# Altium schematic sheet TIDA-01576_ADS8686S_ISO_Interface_Pg4-Isolated Power Supply.SchDoc: Isolated Power Supply
size 431 x 279 mm; Date: Not shown in title block; ApprovedBy: Not shown in title block; CheckedBy: Not shown in title block; Author: Not shown in title block; CompanyName: Not shown in title block; Engineer: Not shown in title block; Organization: Not shown in title block; Address1: Not shown in title block; Address2: Not shown in title block; Address3: Not shown in title block; Address4: Not shown in title block; DocumentNumber: 1; Revision: Use project parameter SCH_Rev; SheetNumber: 4; SheetTotal: 8; PageSetup: Record=PageOptions|CenterHorizontal=True|CenterVertical=True|PrintScale=1.00|XCorrection=1.00|YCorrection=1.00|PrintKind=0|BorderSize=5000000|LeftOffset=0|BottomOffset=0|Orientation=2|PaperLength=1000|PaperWidth=1000|Scale=100|PaperSource=15|PrintQuality=600|MediaType=1|DitherType=10|PaperKind=Letter|PrintScaleMode=1; CurrentTime: Not shown in title block; CurrentDate: Not shown in title block; Time: Not shown in title block; DocumentFullPathAndName: Not shown in title block; DocumentName: Not shown in title block; ModifiedDate: Not shown in title block; ImagePath: Not shown in title block
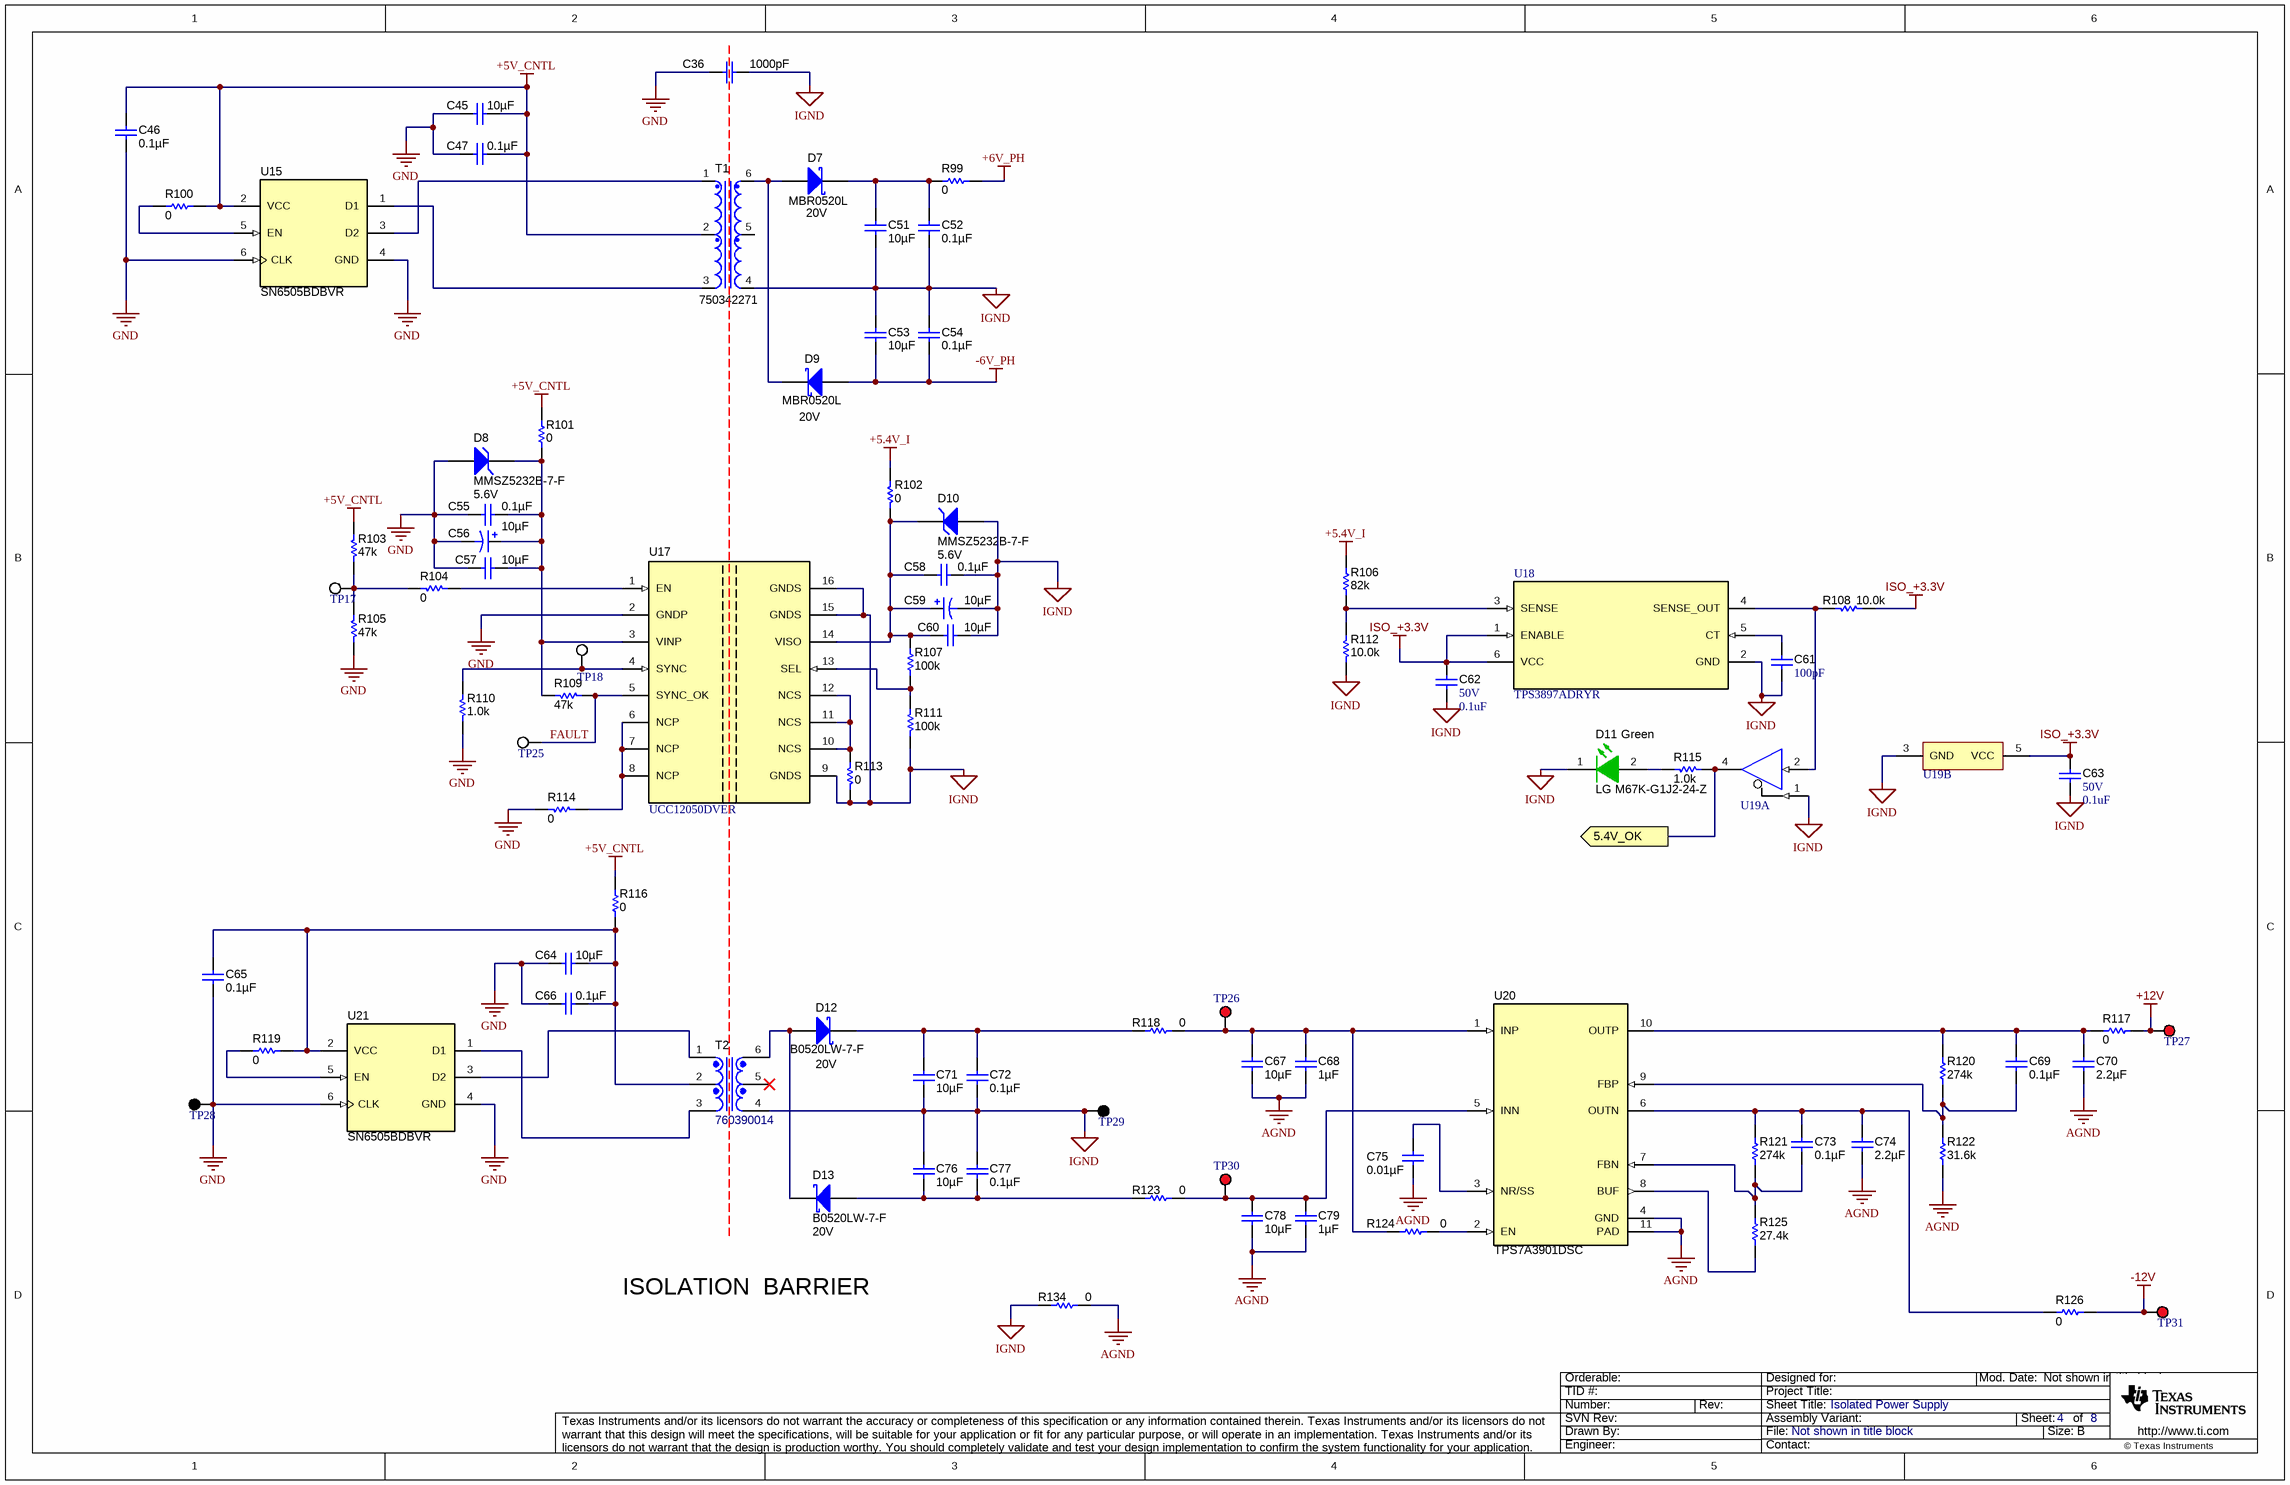
[diagram p0: TIDA-01576_ADS8686S_ISO_Interface_Pg4-Isolated Power Supply.SchDoc]

## Parts
C36  value 1000pF  [CAP_200mil]
C45  ValueDisplayed: 10µF  [1210]
C46  ValueDisplayed: 0.1µF  [0603]
C47  ValueDisplayed: 0.1µF  [0603]
C51  ValueDisplayed: 10µF  [1210]
C52  ValueDisplayed: 0.1µF  [0603_HV]
C53  ValueDisplayed: 10µF  [1210]
C54  ValueDisplayed: 0.1µF  [0603_HV]
C55  ValueDisplayed: 0.1µF  [0603]  (hidden comment: C0603C104K5RACTU)
C56  ValueDisplayed: 10µF  [3528-21]  (hidden comment: T491B106K016AT)
C57  ValueDisplayed: 10µF  [1206_180]  (hidden comment: GRM31CR61H106KA12L)
C58  ValueDisplayed: 0.1µF  [0603]  (hidden comment: C0603C104K5RACTU)
C59  ValueDisplayed: 10µF  [3528-21]  (hidden comment: T491B106K016AT)
C60  ValueDisplayed: 10µF  [1206_180]  (hidden comment: GRM31CR61H106KA12L)
C61  ValueDisplayed: 100pF  [0603]  (hidden comment: 06035A101FAT2A)
C62  VDC_V: 50V  ValueDisplayed: 0.1uF  [0603]  (hidden comment: C0603C104K5RACTU)
C63  VDC_V: 50V  ValueDisplayed: 0.1uF  [0603]  (hidden comment: C0603C104K5RACTU)
C64  ValueDisplayed: 10µF  [1210]
C65  ValueDisplayed: 0.1µF  [0603]
C66  ValueDisplayed: 0.1µF  [0603]
C67  ValueDisplayed: 10µF  [1206_180]  (hidden comment: C1210C106M5RACTU)
C68  ValueDisplayed: 1µF  [0603]  (hidden comment: C1608X7R1E105K080AB)
C69  ValueDisplayed: 0.1µF  [0603]  (hidden comment: GMK107BJ104KAHT)
C70  ValueDisplayed: 2.2µF  [0805_HV]  (hidden comment: C0805C225K8RACTU)
C71  ValueDisplayed: 10µF  [1210]
C72  ValueDisplayed: 0.1µF  [0603]
C73  ValueDisplayed: 0.1µF  [0603]  (hidden comment: GMK107BJ104KAHT)
C74  ValueDisplayed: 2.2µF  [0805_HV]  (hidden comment: C0805C225K8RACTU)
C75  ValueDisplayed: 0.01µF  [0603]  (hidden comment: GRM188R70J103KA01D)
C76  ValueDisplayed: 10µF  [1210]
C77  ValueDisplayed: 0.1µF  [0603]
C78  ValueDisplayed: 10µF  [1206_180]  (hidden comment: C1210C106M5RACTU)
C79  ValueDisplayed: 1µF  [0603]  (hidden comment: C1608X7R1E105K080AB)
D7  MBR0520L  value 20V  [SOD-123]
D8  MMSZ5232B-7-F  value 5.6V  [SOD-123]
D9  MBR0520L  value 20V  [SOD-123]
D10  MMSZ5232B-7-F  value 5.6V  [SOD-123]
D11  LG M67K-G1J2-24-Z  value Green  [LG_M67K_Green]
D12  B0520LW-7-F  value 20V  [SOD-123]
D13  B0520LW-7-F  value 20V  [SOD-123]
R99  ValueDisplayed: 0  [0603]  (hidden comment: CRCW06030000Z0EA)
R100  value 0  [0603]  (hidden comment: CRCW06030000Z0EA)
R101  ValueDisplayed: 0  [0603]  (hidden comment: CRCW06030000Z0EA)
R102  ValueDisplayed: 0  [0603]  (hidden comment: CRCW06030000Z0EA)
R103  ValueDisplayed: 47k  [0603]  (hidden comment: RC0603JR-0747KL)
R104  ValueDisplayed: 0  [0603]  (hidden comment: CRCW06030000Z0EA)
R105  ValueDisplayed: 47k  [0603]  (hidden comment: RC0603JR-0747KL)
R106  ValueDisplayed: 82k  [0603]  (hidden comment: CRCW060382K0JNEA)
R107  ValueDisplayed: 100k  [0603]  (hidden comment: RC0603FR-07100KL)
R108  value 10.0k  [0603]  (hidden comment: CRCW060310K0FKEA)
R109  ValueDisplayed: 47k  [0603]  (hidden comment: RC0603JR-0747KL)
R110  ValueDisplayed: 1.0k  [0603]  (hidden comment: RC0603JR-071KL)
R111  ValueDisplayed: 100k  [0603]  (hidden comment: RC0603FR-07100KL)
R112  value 10.0k  [0603]  (hidden comment: CRCW060310K0FKEA)
R113  ValueDisplayed: 0  [0603]  (hidden comment: CRCW06030000Z0EA)
R114  ValueDisplayed: 0  [0603]  (hidden comment: CRCW06030000Z0EA)
R115  ValueDisplayed: 1.0k  [0603]  (hidden comment: RC0603JR-071KL)
R116  value 0  [0603]  (hidden comment: CRCW06030000Z0EA)
R117  ValueDisplayed: 0  [0603]  (hidden comment: CRCW06030000Z0EA)
R118  ValueDisplayed: 0  [0603]  (hidden comment: CRCW06030000Z0EA)
R119  value 0  [0603]  (hidden comment: CRCW06030000Z0EA)
R120  ValueDisplayed: 274k  [0603]  (hidden comment: CRCW0603274KFKEA)
R121  ValueDisplayed: 274k  [0603]  (hidden comment: CRCW0603274KFKEA)
R122  ValueDisplayed: 31.6k  [0603]  (hidden comment: CRCW060331K6FKEA)
R123  ValueDisplayed: 0  [0603]  (hidden comment: CRCW06030000Z0EA)
R124  ValueDisplayed: 0  [0603]  (hidden comment: CRCW06030000Z0EA)
R125  ValueDisplayed: 27.4k  [0603]  (hidden comment: CRCW060327K4FKEA)
R126  ValueDisplayed: 0  [0603]  (hidden comment: CRCW06030000Z0EA)
R134  ValueDisplayed: 0  [0603]  (hidden comment: CRCW06030000Z0EA)
T1  750342271  [760390015]
T2  760390014  [Wurth_760390013]
TP17  5002  [Keystone5002]  (value not drawn)
TP18  5002  [Keystone5002]  (value not drawn)
TP25  5002  [Keystone5002]  (value not drawn)
TP26  5000  [Keystone5000]  (value not drawn)
TP27  5000  [Keystone5000]  (value not drawn)
TP28  5001  [Keystone5001]  (value not drawn)
TP29  5001  [Keystone5001]  (value not drawn)
TP30  5000  [Keystone5000]  (value not drawn)
TP31  5000  [Keystone5000]  (value not drawn)
U15  SN6505BDBVR  [DBV0006A_N]
U17  UCC12050DVER  [DVE0016A]
U18  TPS3897ADRYR  [DRY0006A]
U19  SN74LVC1G125DCKR  [DCK0005A_N]  (value not drawn)  (parts A,B of 2)
U20  TPS7A3901DSC  [DSC0010J]
U21  SN6505BDBVR  [DBV0006A_N]

## Ports
5.4V_OK (out)

## Nets
+5.4V_I: R102.2 R106.1
+5V_CNTL: C45.2 C46.2 C47.2 R100.1 R101.2 R103.2 R116.2 T1.2 U15.2(VCC)
+6V_PH: R99.1
+12V: R117.2 TP27.1
-6V_PH: C53.2 C54.2 D9.2(A)
-12V: R126.2 TP31.1
AGND: C67.1 C68.2 C70.2 C74.2 C75.2 C78.1 C79.2 R122.1 R134.2 U20.4(GND) U20.11(PAD)
GND: C36.1 C45.1 C46.1 C47.1 C55.1 C56.2(-) C57.2 C64.1 C65.1 C66.1 D8.2(A) R105.1 R110.1 R114.2 TP28.1 U15.4(GND) U15.6(CLK) U17.2(GNDP) U21.4(GND) U21.6(CLK)
IGND: C36.2 C51.2 C52.2 C53.1 C54.1 C58.1 C59.2(-) C60.1 C61.2 C62.1 C63.2 C71.2 C72.2 C76.1 C77.1 D10.2(A) D11.1(K) R111.1 R112.2 R113.2 R134.1 T1.4 T2.4 TP29.1 U17.9(GNDS) U17.15(GNDS) U17.16(GNDS) U18.2(GND) U19.1(~{OE}) U19.3(GND)
ISO_+3.3V: C62.2 C63.1 R108.1 U18.1(ENABLE) U18.6(VCC) U19.5(VCC)
5.4V_OK: R115.2 U19.4(Y) ; port 5.4V_OK
FAULT: R109.1 TP25.1 U17.5(SYNC_OK)
NetC51_1: C51.1 C52.1 D7.1(K) R99.2
NetC55_2: C55.2 C56.1(+) C57.1 D8.1(K) R101.1 R109.2 U17.3(VINP)
NetC58_2: C58.2 C59.1(+) C60.2 D10.1(K) R102.1 R107.2 U17.14(VISO)
NetC61_1: C61.1 U18.5(CT)
NetC64_2: C64.2 C65.2 C66.2 R116.1 R119.1 T2.2 U21.2(VCC)
NetC67_2: C67.2 C68.1 R118.2 R124.1 TP26.1 U20.1(INP)
NetC69_1: C69.1 C70.1 R117.1 R120.2 U20.10(OUTP)
NetC69_2: C69.2 R120.1 R122.2 U20.9(FBP)
NetC71_1: C71.1 C72.1 D12.1(K) R118.1
NetC73_1: C73.1 C74.1 R121.2 R126.1 U20.6(OUTN)
NetC73_2: C73.2 R121.1 R125.2 U20.7(FBN)
NetC75_1: C75.1 U20.3(NR/SS)
NetC76_2: C76.2 C77.2 D13.2(A) R123.1
NetC78_2: C78.2 C79.1 R123.2 TP30.1 U20.5(INN)
NetD7_2: D7.2(A) D9.1(K) T1.6
NetD11_2: D11.2(A) R115.1
NetD12_2: D12.2(A) D13.1(K) T2.6
NetR100_2: R100.2 U15.5(EN)
NetR103_1: R103.1 R104.2 R105.2 TP17.1
NetR104_1: R104.1 U17.1(EN)
NetR106_2: R106.2 R112.1 U18.3(SENSE)
NetR107_1: R107.1 R111.2 U17.13(SEL)
NetR108_2: R108.2 U18.4(SENSE_OUT) U19.2(A)
NetR110_2: R110.2 TP18.1 U17.4(SYNC)
NetR113_1: R113.1 U17.10(NCS) U17.11(NCS) U17.12(NCS)
NetR114_1: R114.1 U17.6(NCP) U17.7(NCP) U17.8(NCP)
NetR119_2: R119.2 U21.5(EN)
NetR124_2: R124.2 U20.2(EN)
NetR125_1: R125.1 U20.8(BUF)
NetT1_1: T1.1 U15.3(D2)
NetT1_3: T1.3 U15.1(D1)
NetT2_1: T2.1 U21.3(D2)
NetT2_3: T2.3 U21.1(D1)

Not connected (* = marked no-connect by the designer): T1 5; T2 5*

## Notes on the sheet
- ISOLATION  BARRIER
- Drawn By:
- SVN Rev:
- Number:
- TID #:
- Orderable:
- Rev:
- Sheet Title:
- File:
- Project Title:
- Designed for:
- Assembly Variant:
- Mod. Date:
- Sheet:
- Size:
- of
- B
- http://www.ti.com
- Texas Instruments and/or its licensors do not warrant the accuracy or completeness of this specification or any information contained therein. Texas Instruments and/or its licensors do not warrant that this design will meet the specifications, will be suitable for your application or fit for any particular purpose, or will operate in an implementation. Texas Instruments and/or its licensors do not warrant that the design is production worthy. You should completely validate and test your design implementation to confirm the system functionality for your application.
- Engineer:
- Contact:
- © Texas Instruments

## Library data of the parts
C36 = 202R18W102KV4E: CAP CER 1000PF 1KV 10% RADIAL; PartNumber: S102K29Y5PN63J5R; Manufacturer: Vishay BC Components; Polarized: N; CompType: Capacitor; Tolerance_%: 0; ValueDisplayed: 1000pF; RoHS: Y; Value2: 1kv; MountType: radial; Technology: Ceramic; Publisher: Texas Instruments; ComponentLink1Description: Datasheet link; ComponentLink1URL: http://www.johansondielectrics.com/images/stories/catalog/JDI-Product-Catalog.pdf; Supplier 1: Digi-Key; Supplier Part Number 1: 1251PH-ND
C45 C51 C53 C64 C71 C76 = GMK325AB7106MM-T: CAP, CERM, 10uF, 35V, +/-20%, X7R, 1210; Manufacturer: Taiyo Yuden; Polarized: N; CompType: Capacitor; U/M: EA; Cap_F: 0.00001; Tolerance_%: 20; Value1: Unknown; VDC_V: 35; TaMin_C: -55; TaMax_C: 125; PackageReference: 1210; PartNumber: GMK325AB7106MM-T; SymbolVersion: 2008-07-09; Value: 10uF; RoHS: Y; Value2: 35V; MountType: SMT; Technology: Ceramic; Cap_Case: 1210; Publisher: Texas Instruments; LatestRevisionDate: 2013-12-06; ComponentLink1Description: Datasheet link; ComponentLink1URL: http://www.yuden.co.jp/productdata/catalog/en/mlcc01_e.pdf; Supplier 1: Digi-Key; Supplier Part Number 1: 587-2779-1-ND; Supplier 2: Mouser; Supplier Part Number 2: 963-GMK325AB7106MM-T; Supplier 3: Farnell; Supplier Part Number 3: 1894510; TempCo: X7R; Published: 2008-06-19
C46 C47 C55 C58 C65 C66 C72 C77 = C0603C104K5RACTU: CAP, CERM, 0.1uF, 50V, +/-10%, X7R, 0603; Manufacturer: Kemet; Polarized: N; CompType: Capacitor; U/M: EA; Cap_F: 0.0000001; Tolerance_%: 10; Value1: Unknown; VDC_V: 50; TaMin_C: -55; TaMax_C: 125; SymbolVersion: 2008-07-09; Value: 0.1uF; PartNumber: C0603C104K5RACTU; PackageReference: 0603; RoHS: Y; Value2: 50V; MountType: SMT; Technology: Ceramic; TempCo: X7R; Cap_Case: 0603; Published: 2008-06-19; Publisher: Texas Instruments; LatestRevisionDate: 2013-12-06; ComponentLink1Description: Datasheet link; ComponentLink1URL: http://www.kemet.com/kemet/web/homepage/kechome.nsf/vapubfiles/F3102_Y5V.pdf/$file/F3102_Y5V.pdf; Supplier 1: Digi-Key; Supplier Part Number 1: 399-5089-1-ND; Supplier 2: Mouser; Supplier Part Number 2: 80-C0603C104K5R; Supplier 3: Farnell; Supplier Part Number 3: 1288255
C52 C54 = C0603C104K5RACTU: CAP, CERM, 0.1uF, 50V, +/-10%, X7R, 0603; Manufacturer: Kemet; Polarized: N; CompType: Capacitor; U/M: EA; Cap_F: 0.0000001; Tolerance_%: 10; Value1: Unknown; VDC_V: 50; TaMin_C: -55; TaMax_C: 125; Cap_Case: 0603; SymbolVersion: 2008-07-09; Value: 0.1uF; PartNumber: C0603C104K5RACTU; PackageReference: 0603; RoHS: Y; Value2: 50V; MountType: SMT; Technology: Ceramic; TempCo: X7R; Published: 2008-06-19; Publisher: Texas Instruments; LatestRevisionDate: 2013-12-06; ComponentLink1Description: Datasheet link; ComponentLink1URL: http://www.kemet.com/kemet/web/homepage/kechome.nsf/vapubfiles/F3102_Y5V.pdf/$file/F3102_Y5V.pdf; Supplier 1: Digi-Key; Supplier Part Number 1: 399-5089-1-ND; Supplier 2: Mouser; Supplier Part Number 2: 80-C0603C104K5R; Supplier 3: Farnell; Supplier Part Number 3: 1288255
C56 C59 = 293D106X9016B2TE3: CAP, TA, 10 µF, 16 V, +/- 10%, 2 ohm, SMD; Manufacturer: Vishay-Sprague; Polarized: Y; CompType: Capacitor; Value: 10uF; U/M: EA; Cap_F: 0.00001; Tolerance_%: 10; Value1: 2 ohm; VDC_V: 16; Value2: 16V; ESR_ohm: 2; IRMS_A: 0.21; TaMin_C: -55; TaMax_C: 125; Cap_Case: B; SymbolVersion: 2008-07-09; PartNumber: T491B106K016AT; PackageReference: 3528-21; RoHS: Y; MountType: SMT; Technology: TA; Series: 293D; Publisher: Texas Instruments; LatestRevisionDate: 2014-08-11; LatestRevisionNote: Updated supplier links; ComponentLink1Description: Datasheet link; ComponentLink1URL: http://www.vishay.com/docs/40002/293d.pdf; Supplier 1: Digi-Key; Supplier Part Number 1: 399-3706-1-ND
C57 C60 = GRM31CR61H106KA12L: CAP, CERM, 10 µF, 50 V, +/- 10%, X5R, 1206; Manufacturer: MuRata; Polarized: N; CompType: Capacitor; Value: 10uF; U/M: EA; Cap_F: 0.00001; Tolerance_%: 10; Value1: Unknown; VDC_V: 50; Value2: 50V; TaMin_C: -55; TaMax_C: 85; Cap_Case: 1206; SizeArea_mm2: 5.12; SizeAreaWB_mm2: 10.92; SizeX_mm: 3.2; SizeY_mm: 1.6; SizeZ_mm: 1.8; AEC Category: Q200; SymbolVersion: 2008-07-09; PartNumber: GRM31CR61H106KA12L; PackageReference: 1206; RoHS: Y; MountType: SMT; Technology: Ceramic; TempCo: X5R; Published: 2008-06-19; Publisher: Texas Instruments; LatestRevisionDate: 2016-10-28; ComponentLink1Description: Datasheet link; ComponentLink1URL: http://search.murata.co.jp/Ceramy/image/img/A01X/G101/ENG/GRM31CR61H106KA12-01.pdf; Supplier 1: Digi-Key; Supplier Part Number 1: 490-5961-1-ND; Supplier 2: Mouser; Supplier Part Number 2: 81-GRM31CR61H106KA2L; Supplier 3: Farnell; Supplier Part Number 3: 1845762RL; AEC Qualified: N; AEC Grade: N/A
C61 = CMP-0006762-4: CAP, CERM, 100 pF, 50 V, +/- 1%, C0G/NP0, 0603; Manufacturer: AVX; TaMin_C: -55°C; Polarized: N; SizeAreaWB_mm2: 4.68; Value1: Unknown; U/M: EA; TaMax_C: 125°C; SizeZ_mm: 1; SizeX_mm: 1.6; SizeY_mm: 0.8; Value2: 50V; SizeArea_mm2: 1.28; Value: 100pF; AEC Category: Q200; Supplier Part Number 2: 95W2725; Publisher: Texas Instruments; Supplier 2: Newark; Supplier Part Number 3: 581-06035A101F; TempCo: C0G/NP0; Supplier 3: Mouser; Published: 2008-06-19; RoHS: Y; MountType: SMT; Supplier 1: Digi-Key; PackageReference: 0603; Tolerance_%: 1%; Cap_Case: 0603; CompType: Capacitor; LatestRevisionDate: 2017-03-09; PartNumber: 06035A101FAT2A; AEC Qualified: N; Cap_F: 100pF; VDC_V: 50V; ComponentLink1Description: Datasheet link; AEC Grade: N/A; Supplier Part Number 1: 478-6202-1-ND; Technology: Ceramic; ComponentLink1URL: http://datasheets.avx.com/C0GNP0-Dielectric.pdf
C62 C63 = CMP-0006861-4: CAP, CERM, 0.1 uF, 50 V, +/- 10%, X7R, 0603; Manufacturer: Kemet; TaMin_C: -55°C; Polarized: N; SizeAreaWB_mm2: 4.68; Value1: Unknown; U/M: EA; Value: 0.1uF; TaMax_C: 125°C; SizeZ_mm: 1; SizeX_mm: 1.6; SizeY_mm: 0.8; SizeArea_mm2: 1.28; Cap_F: 100nF; AEC Category: Q200; Supplier Part Number 2: 80-C0603C104K5R; Publisher: Texas Instruments; Supplier 2: Mouser; Supplier Part Number 3: 1288255; TempCo: X7R; Supplier 3: Farnell; Published: 2008-06-19; RoHS: Y; MountType: SMT; Supplier 1: Digi-Key; PackageReference: 0603; Tolerance_%: 10%; Cap_Case: 0603; Value2: 50V; CompType: Capacitor; LatestRevisionDate: 2017-03-09; PartNumber: C0603C104K5RACTU; AEC Qualified: ?; ComponentLink1Description: Datasheet link; Supplier Part Number 1: 399-5089-1-ND; Technology: Ceramic; ComponentLink1URL: http://www.kemet.com/kemet/web/homepage/kechome.nsf/vapubfiles/F3102_Y5V.pdf/$file/F3102_Y5V.pdf
C67 C78 = CL31B106KBHNNNE: CAP, CERM, 10µF ±20% 50V Ceramic Capacitor X7R 1210; Manufacturer: Kemet; Polarized: N; Value: 10uF; U/M: EA; Cap_F: 0.00001; Tolerance_%: 10; Value1: Unknown; VDC_V: 50; TaMin_C: -55; TaMax_C: 125; Cap_Case: 1206; SizeArea_mm2: 5.12; SizeAreaWB_mm2: 10.92; SizeX_mm: 3.2; SizeY_mm: 1.6; SizeZ_mm: 1.8; AEC Category: Q200; CompType: Capacitor; SymbolVersion: 2008-07-09; PartNumber: C1210C106M5RACTU; PackageReference: 1206; RoHS: Y; Value2: 50V; MountType: SMT; Technology: Ceramic; TempCo: X7R; Published: 2008-06-19; Publisher: Texas Instruments; LatestRevisionDate: 2017-05-28; ComponentLink1Description: Datasheet link; ComponentLink1URL: https://www.samsungsem.com/kr/front/downloadcms.do?path=%2Fkr%2Fsupport%2Fproduct-search%2Fmlcc%2F__icsFiles%2Fafieldfile%2F2016%2F01%2F04&fileName=Data+sheet_CL31B106KBHNNNE.pdf; Supplier 1: Digi-Key; Supplier Part Number 1: 399-11630-1-ND; AEC Qualified: N; AEC Grade: N/A
C68 C79 = 885012206052: CAP, CERM,  1µF ±10% 25V Ceramic Capacitor X7R 0603; Manufacturer: TDK; Polarized: N; Value: 1uF; U/M: EA; Cap_F: 0.000001; Tolerance_%: 10; Value1: Unknown; VDC_V: 16; Value2: 16V; TaMin_C: -55; TaMax_C: 125; SizeArea_mm2: 1.28; SizeAreaWB_mm2: 4.68; SizeX_mm: 1.6; SizeY_mm: 0.8; SizeZ_mm: 1; AEC Category: Q200; Green_Lifecycle: Active; Green_REACh: Passed; CompType: Capacitor; SymbolVersion: 2008-07-09; PartNumber: C1608X7R1E105K080AB; PackageReference: 0603; RoHS: Y; MountType: SMT; Technology: Ceramic; TempCo: X7R; Cap_Case: 0603; Published: 2008-06-19; Publisher: Texas Instruments; LatestRevisionDate: 2017-05-28; ComponentLink1Description: Datasheet link; ComponentLink1URL: http://katalog.we-online.de/pbs/datasheet/885012206052.pdf; Supplier 1: Digi-Key; Supplier Part Number 1: 445-5956-1-ND; AEC Qualified: N; AEC Grade: N/A; Green_EU RoHS: Passed; Green_EU RoHS-2: Incomplete
C69 C73 = 06033C104JAT2A: 0.1µF ±10% 35V Ceramic Capacitor X5R 0603; Manufacturer: Taiyo Yuden; Polarized: N; Value: 0.1uF; U/M: EA; Cap_F: 0.0000001; Tolerance_%: 5; ESR_ohm: 0.05; Value1: 0.05 ohm; VDC_V: 25; Value2: 25V; TempCo: X7R; TaMin_C: -55; TaMax_C: 125; SizeArea_mm2: 1.28; SizeAreaWB_mm2: 4.68; SizeX_mm: 1.6; SizeY_mm: 0.8; SizeZ_mm: 1; AEC Category: Q200; CompType: Capacitor; SymbolVersion: 2008-07-09; PartNumber: GMK107BJ104KAHT; PackageReference: 0603; RoHS: Y; MountType: SMT; Technology: Ceramic; Cap_Case: 0603; Published: 2008-06-19; Publisher: Texas Instruments; LatestRevisionDate: 2017-04-15; ComponentLink1Description: Datasheet link; ComponentLink1URL: http://datasheets.avx.com/X7RDielectric.pdf; Supplier 1: Digi-Key; Supplier Part Number 1: 587-3357-1-ND; AEC Qualified: N; AEC Grade: N/A
C70 C74 = C0805C225K8RACTU: CAP, CERM, 2.2uF, 10V, +/-10%, X7R, 0805; Manufacturer: Kemet; Polarized: N; CompType: Capacitor; U/M: EA; Cap_F: 0.0000022; Tolerance_%: 10; ESR_Ohm: 0.008; Value1: 0.008 ohm; IRMS_A: 15.55; TaMin_C: -55; TaMax_C: 125; Cap_Case: 0805; SymbolVersion: 2008-07-09; Value: 2.2uF; PartNumber: C0805C225K8RACTU; PackageReference: 0805; RoHS: Y; VDC_V: 10; Value2: 10V; MountType: SMT; Technology: Ceramic; TempCo: X7R; Published: 2008-06-19; Publisher: Texas Instruments; LatestRevisionDate: 2014-05-28; ComponentLink1Description: Datasheet link; ComponentLink1URL: http://www.kemet.com/kemet/web/homepage/kechome.nsf/file/Partial%20Copy%20-%20Ceramic%20Surface%20Mount%20Capacitors/$file/F3102_CE.pdf; Supplier 1: Digi-Key; Supplier Part Number 1: 399-3522-1-ND; Supplier 2: Mouser; Supplier Part Number 2: 80-C0805C225K8R
C75 = GRM188R70J103KA01D: CAP, CERM, 0.01 µF, 6.3 V, +/- 10%, X7R, 0603; Manufacturer: MuRata; Polarized: N; CompType: Capacitor; Value: 0.01uF; U/M: EA; Cap_F: 0.00000001; Tolerance_%: 10; Value1: Unknown; VDC_V: 6.3; Value2: 6.3V; TaMin_C: -55; TaMax_C: 125; SymbolVersion: 2008-07-09; PartNumber: GRM188R70J103KA01D; PackageReference: 0603; RoHS: Y; MountType: SMT; Technology: Ceramic; TempCo: X7R; Cap_Case: 0603; Published: 2008-06-19; Publisher: Texas Instruments; LatestRevisionDate: 2015-02-10; ComponentLink1Description: Datasheet link; ComponentLink1URL: http://search.murata.co.jp/Ceramy/PnsearchViewAction.do?HnOFG=ON&HnNFG=ON&SEL_CNT=50&sLang=en&sKey=GRM188R70J103KA01D&x=9&y=9&search=startwith; Supplier 1: Digi-Key; Supplier Part Number 1: GRM188R70J103KA01D-ND
D7 D9 = MBR0520LT1G: Diode, Schottky, 20V, 0.5A, SOD-123; Manufacturer: Fairchild Semiconductor; U/M: EA; Vf_V: 0.385; Value2: 0.385V; Io_A: 0.5; Vr_V: 20; TJmax_C: 125; RJC_CperW: 150; CompType: Diode; SymbolVersion: 2008-12-08; PartNumber: MBR0520L; PackageReference: SOD-123; Value1: 0.5A; MountType: SMT; Type: Schottky; RoHS: Y; Published: 2008-06-26; Publisher: Texas Instruments; LatestRevisionDate: 2013-12-18; ComponentLink1Description: Datasheet link; ComponentLink1URL: http://www.onsemi.com/pub_link/Collateral/MBR0520LT1-D.PDF; Supplier 1: Digi-Key; Supplier Part Number 1: MBR0520LCT-ND; Supplier 2: Mouser; Supplier Part Number 2: 863-MBR0520LT1G; Supplier 3: Farnell; Supplier Part Number 3: 9556915
D8 D10 = MMSZ5232B-7-F: Diode, Zener, 5.6 V, 500 mW, SOD-123; Manufacturer: Diodes Inc.; SymbolCreator: a0412235; U/M: EA; Power_W: 0.5; Vz_V: 5.6; Value1: 0.5W; RJA_CperW: 350; AEC Category: Q101; SymbolVersion: 2010-08-25; PartNumber: MMSZ5232B-7-F; PackageReference: SOD-123; CompType: Zener; Vr_V: N/A; MountType: SMT; RoHS: Y; ComponentLink1Description: Datasheet link; ComponentLink1URL: http://www.diodes.com/datasheets/ds18010.pdf; Published: 2008-10-08; Publisher: Texas Instruments; LatestRevisionDate: 2016-03-21; LatestRevisionNote: Updated Supplier Data; Supplier 1: Digi-Key; Supplier Part Number 1: MMSZ5232B-FDICT-ND; Supplier 2: Mouser; Supplier Part Number 2: 621-MMSZ5232B-F; Supplier 3: Farnell; Supplier Part Number 3: 2061469; AEC Qualified: ?
D11 = LG M67K-G1J2-24-Z: LED, Green, SMD; Manufacturer: OSRAM; SymbolCreator: Altium; Type: AlInGaP; Vf_V: 1.8; Value2: 1.8V; Io_A: 0.002; Vr_V: 12; Tjmax_C: 125; Value1: W; Angle: 120; U/M: EA; SymbolVersion: 2015-01-20; PartNumber: LG M67K-G1J2-24-Z; PackageReference: 2x1.4mm; RoHS: Y; CompType: LED; MountType: SMT; Color: Green; Published: 2008-07-11; Publisher: Texas Instruments; ComponentLink1URL: http://www.digikey.com/product-detail/en/LG%20M67K-G1J2-24-Z/475-1406-1-ND/1802594; ComponentLink1Description: Datasheet link; LatestRevisionDate: 2016-09-26; Supplier 1: Digi-Key; Supplier Part Number 1: 475-1406-1-ND; Supplier 2: Mouser; Supplier Part Number 2: 720-LGM67KG1J224Z
D12 D13 = MBR0520LT1G: Diode, Schottky, 20V, 0.5A, SOD-123; Manufacturer: Diodes Inc; U/M: EA; Vf_V: 0.385; Value2: 0.385V; Io_A: 0.5; Vr_V: 20; TJmax_C: 125; RJC_CperW: 150; CompType: Diode; PartNumber: B0520LW-7-F; PackageReference: SOD-123; Value1: 0.5A; MountType: SMT; Type: Schottky; RoHS: Y; Published: 2008-06-26; Publisher: Texas Instruments; LatestRevisionDate: 2013-12-18; ComponentLink1Description: Datasheet link; ComponentLink1URL: http://www.onsemi.com/pub_link/Collateral/MBR0520LT1-D.PDF; Supplier 1: Digi-Key; Supplier Part Number 1: B0520LW-FDICT-ND
R99 R101 R102 R104 R113 R114 R117 R118 R123 R124 R126 R134 = CRCW06030000Z0EA: RES, 0, 5%, 0.1 W, 0603; Manufacturer: Vishay-Dale; CompType: Resistor; Value: 0; Value_Code: 0000; Tolerance_%: 5; Power_W: 0.1; Value2: 0.1W; VDC_V: 75; TempCo: 200 ppm/C; EIA_Code: E24; U/M: EA; SymbolVersion: 2009-05-29; PartNumber: CRCW06030000Z0EA; PackageReference: 0603; RoHS: Y; Res_ohm: 0; Value1: 5%; MountType: SMT; Technology: Thick Film; Published: 2008-06-26; Publisher: Texas Instruments; ComponentLink1Description: Datasheet link; ComponentLink1URL: http://www.vishay.com/docs/20035/dcrcwe3.pdf; Supplier 1: Digi-Key; Supplier Part Number 1: 541-0.0GCT-ND; Supplier 2: Mouser; Supplier Part Number 2: 71-CRCW0603-0-E3; Supplier 3: Farnell; Supplier Part Number 3: 1469739
  R99 R101 R102 R104 R113 R114: LatestRevisionDate: 2014-10-21
  R117 R118 R123 R124 R126 R134: LatestRevisionDate: 2014-12-16
R100 R116 R119 = CRCW06030000Z0EA: RES, 0 ohm, 5%, 0.1W, 0603; Manufacturer: Vishay-Dale; CompType: Resistor; Value_Code: 0000; Tolerance_%: 5; Power_W: 0.1; VDC_V: 75; TempCo: 200 ppm/C; EIA_Code: E24; U/M: EA; SymbolVersion: 2009-05-29; PartNumber: CRCW06030000Z0EA; PackageReference: 0603; RoHS: Y; Res_ohm: 0; Value1: 5%; Value2: 0.1W; MountType: SMT; Technology: Thick Film; Published: 2008-06-26; Publisher: Texas Instruments; LatestRevisionDate: 2014-05-20; ComponentLink1Description: Datasheet link; ComponentLink1URL: http://www.vishay.com/docs/20035/dcrcwe3.pdf; Supplier 1: Digi-Key; Supplier Part Number 1: 541-0.0GCT-ND; Supplier 2: Mouser; Supplier Part Number 2: 71-CRCW0603-0-E3; Supplier 3: Farnell; Supplier Part Number 3: 1469739
R103 R105 R109 = RC0603JR-0747KL: RES, 47 k, 5%, 0.1 W, 0603; Manufacturer: Yageo America; CompType: Resistor; Value: 47k; Res_ohm: 47000; Value_Code: 47k0; Tolerance_%: 5; Power_W: 0.1; Value2: 0.1W; VDC_V: 50; TempCo: 100 ppm/C; EIA_Code: E24; U/M: EA; SymbolVersion: 2009-05-29; PartNumber: RC0603JR-0747KL; PackageReference: 0603; RoHS: Y; Value1: 5%; MountType: SMT; Technology: Thick Film; Published: 2008-06-26; Publisher: Texas Instruments; LatestRevisionDate: 2014-12-16; ComponentLink1Description: Datasheet link; ComponentLink1URL: http://www.yageo.com/pdf/Pu-RC0603_51_PbFree_L_2.pdf; Supplier 1: Digi-Key; Supplier Part Number 1: 311-47KGRCT-ND; Supplier 2: Mouser; Supplier Part Number 2: 603-RC0603JR-0747KL; Supplier 3: Farnell; Supplier Part Number 3: 9233580
R106 = CRCW060382K0JNEA: RES, 82 k, 5%, 0.1 W, 0603; Manufacturer: Vishay-Dale; CompType: Resistor; Value: 82k; Res_ohm: 82000; Value_Code: 82k0; Tolerance_%: 5; Power_W: 0.1; Value2: 0.1W; VDC_V: 75; TempCo: 200 ppm/C; SizeArea_mm2: 1.28; SizeX_mm: 1.6; SizeY_mm: 0.8; SizeZ_mm: 1; EIA_Code: E24; U/M: EA; AEC Category: Q200; Green_Lifecycle: Active; Green_REACh: Passed; SymbolVersion: 2009-05-29; PartNumber: CRCW060382K0JNEA; PackageReference: 0603; RoHS: Y; Value1: 5%; MountType: SMT; Technology: Thick Film; Published: 2008-06-26; Publisher: Texas Instruments; LatestRevisionDate: 2017-06-13; ComponentLink1Description: Datasheet link; ComponentLink1URL: http://www.vishay.com/docs/20035/dcrcwe3.pdf; Supplier 1: Digi-Key; Supplier Part Number 1: 541-82KGCT-ND; Supplier 2: Newark; Supplier Part Number 2: 59M6838; Supplier 3: Mouser; Supplier Part Number 3: 71-CRCW060382K0JNEA; AEC Qualified: ?; Green_EU RoHS: Passed with Exemption; Green_EU RoHS-2: Passed
R107 = RC0603FR-07100KL: RES, 100 k, 1%, 0.1 W, 0603; Manufacturer: Yageo America; CompType: Resistor; Value: 100k; Res_ohm: 100000; Tolerance_%: 1; Power_W: 0.1; Value2: 0.1W; VDC_V: 150; TempCo: 200 ppm/C; EIA_Code: E96; U/M: EA; AEC Category: Q200; SymbolVersion: 2009-05-29; PartNumber: RC0603FR-07100KL; PackageReference: 0603; RoHS: Y; Value_Code: 100k; Value1: 1%; MountType: SMT; Technology: Thick Film; Published: 2008-06-26; Publisher: Texas Instruments; LatestRevisionDate: 2015-10-07; ComponentLink1Description: Datasheet link; ComponentLink1URL: http://www.yageo.com/pdf/Pu-RC0603_51_PbFree_L_2.pdf; Supplier 1: Digi-Key; Supplier Part Number 1: 311-100KHRCT-ND; Supplier 2: Mouser; Supplier Part Number 2: 603-RC0603FR-07100KL; Supplier 3: Farnell; Supplier Part Number 3: 9238727; AEC Qualified: ?
R108 R112 = CRCW060310K0FKEA: RES, 10.0k ohm, 1%, 0.1W, 0603; Manufacturer: Vishay-Dale; CompType: Resistor; Res_ohm: 10000; Value_Code: 10k0; Tolerance_%: 1; Power_W: 0.1; VDC_V: 75; TempCo: 100 ppm/C; EIA_Code: E96; U/M: EA; SymbolVersion: 2009-05-29; PartNumber: CRCW060310K0FKEA; PackageReference: 0603; RoHS: Y; Value1: 1%; Value2: 0.1W; MountType: SMT; Technology: Thick Film; Published: 2008-06-26; Publisher: Texas Instruments; LatestRevisionDate: 2013-10-22; ComponentLink1Description: Datasheet link; ComponentLink1URL: http://www.vishay.com/docs/20035/dcrcwe3.pdf; Supplier 1: Digi-Key; Supplier Part Number 1: 541-10.0KHCT-ND; Supplier 2: Mouser; Supplier Part Number 2: 71-CRCW0603-10K-E3; Supplier 3: Farnell; Supplier Part Number 3: 1469748
R110 R115 = RC0603JR-071KL: RES, 1.0 k, 5%, 0.1 W, 0603; Manufacturer: Yageo America; CompType: Resistor; Value: 1.0k; Res_ohm: 1000; Value_Code: 1k00; Tolerance_%: 5; Power_W: 0.1; Value2: 0.1W; VDC_V: 50; TempCo: 100 ppm/C; SizeArea_mm2: 1.28; SizeX_mm: 1.6; SizeY_mm: 0.8; SizeZ_mm: 1; EIA_Code: E24; U/M: EA; AEC Category: Q200; Green_Lifecycle: Active; Green_REACh: Passed; SymbolVersion: 2009-05-29; PartNumber: RC0603JR-071KL; PackageReference: 0603; RoHS: Y; Value1: 5%; MountType: SMT; Technology: Thick Film; Published: 2008-06-26; Publisher: Texas Instruments; LatestRevisionDate: 2017-06-13; ComponentLink1Description: Datasheet link; ComponentLink1URL: http://www.yageo.com/pdf/Pu-RC0603_51_PbFree_L_2.pdf; Supplier 1: Digi-Key; Supplier Part Number 1: 311-1.0KGRCT-ND; Supplier 2: Mouser; Supplier Part Number 2: 603-RC0603JR-071KL; Supplier 3: Farnell; Supplier Part Number 3: 9233385; AEC Qualified: ?; Green_EU RoHS: Passed with Exemption; Green_EU RoHS-2: Passed
R111 = RC0603FR-07100KL: RES, 100 k, 1%, 0.1 W, 0603; Manufacturer: Yageo America; CompType: Resistor; Value: 100k; Res_ohm: 100000; Tolerance_%: 1; Power_W: 0.1; Value2: 0.1W; VDC_V: 150; TempCo: 200 ppm/C; EIA_Code: E96; U/M: EA; SizeArea_mm2: 1.28; SizeX_mm: 1.6; SizeY_mm: 0.8; AEC Category: Q200; Green_Lifecycle: Active; Green_REACh: Passed; SymbolVersion: 2009-05-29; PartNumber: RC0603FR-07100KL; PackageReference: 0603; RoHS: Y; Value_Code: 100k; Value1: 1%; MountType: SMT; Technology: Thick Film; Published: 2008-06-26; Publisher: Texas Instruments; LatestRevisionDate: 2017-06-13; ComponentLink1Description: Datasheet link; ComponentLink1URL: http://www.yageo.com/pdf/Pu-RC0603_51_PbFree_L_2.pdf; Supplier 1: Digi-Key; Supplier Part Number 1: 311-100KHRCT-ND; Supplier 2: Mouser; Supplier Part Number 2: 603-RC0603FR-07100KL; Supplier 3: Farnell; Supplier Part Number 3: 9238727; SizeZ_mm: 1; AEC Qualified: ?; Green_EU RoHS: Passed with Exemption; Green_EU RoHS-2: Passed
R120 R121 = CRCW0603274KFKEA: RES, 274 k, 1%, 0.1 W, 0603; Manufacturer: Vishay-Dale; CompType: Resistor; Value: 274k; Res_ohm: 274000; Tolerance_%: 1; Power_W: 0.1; Value2: 0.1W; VDC_V: 75; TempCo: 100 ppm/C; SizeArea_mm2: 1.28; SizeX_mm: 1.6; SizeY_mm: 0.8; EIA_Code: E96; U/M: EA; AEC Category: Q200; Green_Lifecycle: Active; Green_REACh: Passed; SymbolVersion: 2009-05-29; PartNumber: CRCW0603274KFKEA; PackageReference: 0603; RoHS: Y; Value_Code: 274k; Value1: 1%; MountType: SMT; Technology: Thick Film; SizeZ_mm: 1; Published: 2008-06-26; Publisher: Texas Instruments; LatestRevisionDate: 2017-06-13; ComponentLink1Description: Datasheet link; ComponentLink1URL: http://www.vishay.com/docs/20035/dcrcwe3.pdf; Supplier 1: Digi-Key; Supplier Part Number 1: 541-274KHCT-ND; Supplier 2: Newark; Supplier Part Number 2: 52K8353; Supplier 3: Mouser; Supplier Part Number 3: 71-CRCW0603-274K-E3; AEC Qualified: ?; Green_EU RoHS: Passed with Exemption; Green_EU RoHS-2: Passed
R122 = CRCW060331K6FKEA: RES, 31.6 k, 1%, 0.1 W, 0603; Manufacturer: Vishay-Dale; CompType: Resistor; Value: 31.6k; Res_ohm: 31600; Value_Code: 31k6; Tolerance_%: 1; Power_W: 0.1; Value2: 0.1W; VDC_V: 75; TempCo: 100 ppm/C; SizeArea_mm2: 1.28; SizeX_mm: 1.6; SizeY_mm: 0.8; EIA_Code: E96; U/M: EA; AEC Category: Q200; Green_Lifecycle: Active; Green_REACh: Passed; SymbolVersion: 2009-05-29; PartNumber: CRCW060331K6FKEA; PackageReference: 0603; RoHS: Y; Value1: 1%; MountType: SMT; Technology: Thick Film; SizeZ_mm: 1; Published: 2008-06-26; Publisher: Texas Instruments; LatestRevisionDate: 2017-06-13; ComponentLink1Description: Datasheet link; ComponentLink1URL: http://www.vishay.com/docs/20035/dcrcwe3.pdf; Supplier 1: Digi-Key; Supplier Part Number 1: 541-31.6KHCT-ND; Supplier 2: Newark; Supplier Part Number 2: 52K8416; Supplier 3: Mouser; Supplier Part Number 3: 71-CRCW0603-31.6K-E3; AEC Qualified: ?; Green_EU RoHS: Passed with Exemption; Green_EU RoHS-2: Passed
R125 = CRCW060327K4FKEA: RES, 27.4 k, 1%, 0.1 W, 0603; Manufacturer: Vishay-Dale; CompType: Resistor; Value: 27.4k; Res_ohm: 27400; Value_Code: 27k4; Tolerance_%: 1; Power_W: 0.1; Value2: 0.1W; VDC_V: 75; TempCo: 100 ppm/C; SizeArea_mm2: 1.28; SizeX_mm: 1.6; SizeY_mm: 0.8; EIA_Code: E96; U/M: EA; AEC Category: Q200; Green_Lifecycle: Active; Green_REACh: Passed; SymbolVersion: 2009-05-29; PartNumber: CRCW060327K4FKEA; PackageReference: 0603; RoHS: Y; Value1: 1%; MountType: SMT; Technology: Thick Film; SizeZ_mm: 1; Published: 2008-06-26; Publisher: Texas Instruments; LatestRevisionDate: 2017-06-13; ComponentLink1Description: Datasheet link; ComponentLink1URL: http://www.vishay.com/docs/20035/dcrcwe3.pdf; Supplier 1: Digi-Key; Supplier Part Number 1: 541-27.4KHCT-ND; Supplier 2: Newark; Supplier Part Number 2: 52K8346; Supplier 3: Mouser; Supplier Part Number 3: 71-CRCW0603-27.4K-E3; AEC Qualified: ?; Green_EU RoHS: Passed with Exemption; Green_EU RoHS-2: Passed
T1 = TRNSFMR: Transformer 469uH SMD; Manufacturer: Wurth Electronics Midcom; Alternate Manufacturer: *; RoHS: Y; Value: 469uH; MountType: SMT; PartNumber: 750342271; PackageReference: 10.05mm L x 6.73mm W; Publisher: TI; ComponentLink1Description: Datasheet Link; Alternate PartNumber: *; CompType: Transformer; Supplier 1: Digi-Key
T2 = CMP-0030718-1: Transformer, 475uH, SMT; Manufacturer: Wurth Elektronik; DCR_ohm: 0.31; Lp: 475; Ind_H: 475µH; ComponentLink1URL: http://katalog.we-online.de/ctm/datasheet/760390014.pdf; Supplier Part Number 2: 710-760390014; Publisher: Texas Instruments; Supplier 2: Mouser; RoHS: Y; MountType: SMT; Value: 475uH; Supplier 1: Digi-Key; PackageReference: 10.05x4.19x6.73 mm; CompType: Transformer; LatestRevisionDate: 2017-05-09; PartNumber: 760390014; ComponentLink1Description: Datasheet URL; Supplier Part Number 1: 732-4458-1-ND; ValueDisplayed: 475uH
TP17 TP18 TP25 = 5002: Test Point, Miniature, White, TH; Manufacturer: Keystone; CompType: Test Point Loop; ContactFinish: Silver; Green_Lifecycle: Active; Green_REACh: Passed; SymbolVersion: 2008-04-04; PartNumber: 5002; PackageReference: White Miniature Testpoint; RoHS: Y; MountType: TH; ComponentLink1Description: Datasheet URL; ComponentLink1URL: http://www.keyelco.com/userAssets/file/M60-2p60.pdf; Color: White; Publisher: Texas Instruments; LatestRevisionDate: 2017-05-11; Supplier 1: Digi-Key; Supplier Part Number 1: 36-5002-ND; Supplier 2: Newark; Supplier Part Number 2: 82H9632; Supplier 3: Mouser; Supplier Part Number 3: 534-5002; Green_EU RoHS: Passed; Green_EU RoHS-2: Passed
TP26 TP30 = 5000: Test Point, Miniature, Red, TH; Manufacturer: Keystone; CompType: Test Point Loop; ContactFinish: Silver; Green_Lifecycle: Active; Green_REACh: Passed; SymbolVersion: 2008-04-04; PartNumber: 5000; PackageReference: Red Miniature Testpoint; RoHS: Y; MountType: TH; ComponentLink1Description: Datasheet URL; ComponentLink1URL: http://www.keyelco.com/userAssets/file/M60-2p60.pdf; Color: Red; Publisher: Texas Instruments; LatestRevisionDate: 2017-05-11; Supplier 1: Digi-Key; Supplier Part Number 1: 36-5000-ND; Supplier 2: Mouser; Supplier Part Number 2: 534-5000; Green_EU RoHS: Passed; Green_EU RoHS-2: Incomplete
TP27 TP31 = 5000: Test Point, Miniature, Red, TH; Manufacturer: Keystone; CompType: Test Point Loop; ContactFinish: Silver; SymbolVersion: 2008-04-04; PartNumber: 5000; PackageReference: Red Miniature Testpoint; RoHS: Y; MountType: TH; ComponentLink1Description: Datasheet URL; ComponentLink1URL: http://www.keyelco.com/userAssets/file/M60-2p60.pdf; Color: Red; Publisher: Texas Instruments; LatestRevisionDate: 2016-02-11; Supplier 1: Digi-Key; Supplier Part Number 1: 36-5000-ND; Supplier 2: Mouser; Supplier Part Number 2: 534-5000
TP28 TP29 = 5001: Test Point, Miniature, Black, TH; Manufacturer: Keystone; CompType: Test Point Loop; ContactFinish: Silver; Green_Lifecycle: Active; Green_REACh: Passed; SymbolVersion: 2008-04-04; PartNumber: 5001; PackageReference: Black Miniature Testpoint; RoHS: Y; MountType: TH; ComponentLink1Description: Datasheet URL; ComponentLink1URL: http://www.keyelco.com/userAssets/file/M60-2p60.pdf; Color: Black; Publisher: Texas Instruments; LatestRevisionDate: 2017-05-11; Supplier 1: Digi-Key; Supplier Part Number 1: 36-5001-ND; Supplier 2: Mouser; Supplier Part Number 2: 534-5001; Green_EU RoHS: Passed; Green_EU RoHS-2: Incomplete
U15 U21 = SN6505BDBVR: LOW-NOISE 1A TRANSFORMER DRIVERS FOR ISOLATED POWER SUPPLIES, DBV0006A; Alternate PartNumber: SN6505BDBVT; Manufacturer: Texas Instruments; SymbolCreator: Altium; CompType: IC; U/M: EA; SymbolVersion: 2015-08-03; PartNumber: SN6505BDBVR; PackageReference: DBV0006A; MountType: SMT; ComponentLink1Description: Datasheet Link; ComponentLink1URL: https://sps06.itg.ti.com/sites/KMS/crossdivteams/altium/docs/ComponentDatasheets/SN6505-PPV.pdf; Publisher: Texas Instruments; LatestRevisionDate: 2015-08-06; Alternate Manufacturer: Texas Instruments
U17 = CMP-0081958-3: 500 mW, High-Efficiency, Low-Emissions, 5 kVRMS Isolated DC-DC Converter, DVE0016A (SO-MOD-16); Manufacturer: Texas Instruments; AEC Category: Q200; CompType: IC; SizeAreaWB_mm2: 151.29; SizeZ_mm: 2.65; AEC Qualified: N; SizeArea_mm2: 106.09; SizeY_mm: 10.3; Operating Temperature Range: -40 to 125 C; MountType: SMT; PackageReference: DVE0016A; ComponentLink1Description: Datasheet Link; PartNumber: UCC12050DVER; ComponentLink3URL: http://www.ti.com/product/ucc12050/datasheet; Alternate PartNumber: UCC12050DVE; ComponentLink2URL: http://www.ti.com/product/ucc12050; ComponentLink3Description: Online Datasheet; ComponentLink2Description: Product Folder; PackageDescription: SO-MOD-16; ComponentLink1URL: http://www.ti.com/lit/ds/symlink/ucc12050.pdf; Alternate Manufacturer: Texas Instruments; SizeX_mm: 10.3
U18 = CMP-0032427-3: Single-Channel Ultra-Small Adjustable Supervisory Circuit With Active-High Open-Drain Output, DRY0006A (USON-6); Manufacturer: Texas Instruments; Iq(Typ)(uA): 6; Time Delay(ms): 0.04, Programmable; VCC(Min)(V): 1.7; Reset Threshold Accuracy(%): 0.25; Enable Pin: TRUE; Output Driver Type / Reset Output: Active-High, Open-drain; # of Supplies Monitored: 1; Rating: Catalog; VCC(Max)(V): 6.5; AEC Category: Q200; AEC Qualified: N; CompType: IC; SizeAreaWB_mm2: 4.9; SizeArea_mm2: 1.45; SizeX_mm: 1.0; SizeZ_mm: 0.6; PartNumber: TPS3897ADRYR; Threshold Voltage 1 (typ)(Typ)(V): Adjustable; ComponentLink1URL: http://www.ti.com/lit/ds/symlink/tps3897.pdf; PackageReference: DRY0006A; PackageDescription: USON-6; ComponentLink1Description: Datasheet Link; Active High Enable: TRUE; ComponentLink2Description: Product Folder; ComponentLink2URL: http://www.ti.com/product/tps3897; ComponentLink3Description: Online Datasheet; ComponentLink3URL: http://www.ti.com/product/tps3897/datasheet; MountType: SMT; SizeY_mm: 1.45; Operating Temperature Range: -40 to 125 C
U19 = CMP-0051326-1: Single Bus Buffer Gate With 3-State Outputs, DCK0005A, LARGE T&R; Manufacturer: Texas Instruments; Bits(#): 1; tpd @ Nom Voltage(Max)(ns): 9,5.5,4.5,4; 3-State Output: Yes; Output Type: CMOS; Sub-Family: Non-Inverting Buffer/Driver; Logic: True; Output Drive (IOL/IOH)(Max)(mA): 32/-32; Voltage(Nom)(V): 1.8,2.5,3.3,5; ICC @ Nom Voltage(Max)(mA): 0.01; Technology Family: LVC; VCC(Min)(V): 1.65; VCC(Max)(V): 5.5; F @ Nom Voltage(Max)(Mhz): 150; Rating: Catalog; Input Type: CMOS/TTL; Schmitt Trigger: No; PackageReference: DCK0005A; PartNumber: SN74LVC1G125DCKR; DatasheetVersion: SCES223T; Operating Temperature Range(C): -40 to 125,-40 to 85; PartId: 1
U20 = TPS7A3901DSC: Wide-VIN (±33 V), 150-mA, Spilt-Rail Output, Positive and Negative LDO Voltage Regulator with Startup Tracking, DSC0010J; Manufacturer: Texas Instruments; SymbolCreator: Altium; SizeArea_mm2: 9; SizeAreaWB_mm2: 16; SizeX_mm: 3; SizeZ_mm: 0.8; CompType: IC; U/M: EA; SymbolVersion: 2016-01-29; PartNumber: TPS7A3901DSC; PackageReference: DSC0010J; PackageDescription: WSON-10; MountType: SMT; SizeY_mm: 3; ComponentLink1Description: Datasheet Link; ComponentLink1URL: https://sps06.itg.ti.com/sites/KMS/crossdivteams/altium/docs/ComponentDatasheets/SBVS263.pdf; Publisher: Texas Instruments; LatestRevisionDate: 2016-07-20; Alternate Manufacturer: Texas Instruments; Supplier Part Number 1: 296-47504-1-ND; Supplier 1: Digi-Key